# EAGLE design BigLMA (EAGLE 6.1)
DATABASE: ./../../../../eagle/PARTSDB.TXT
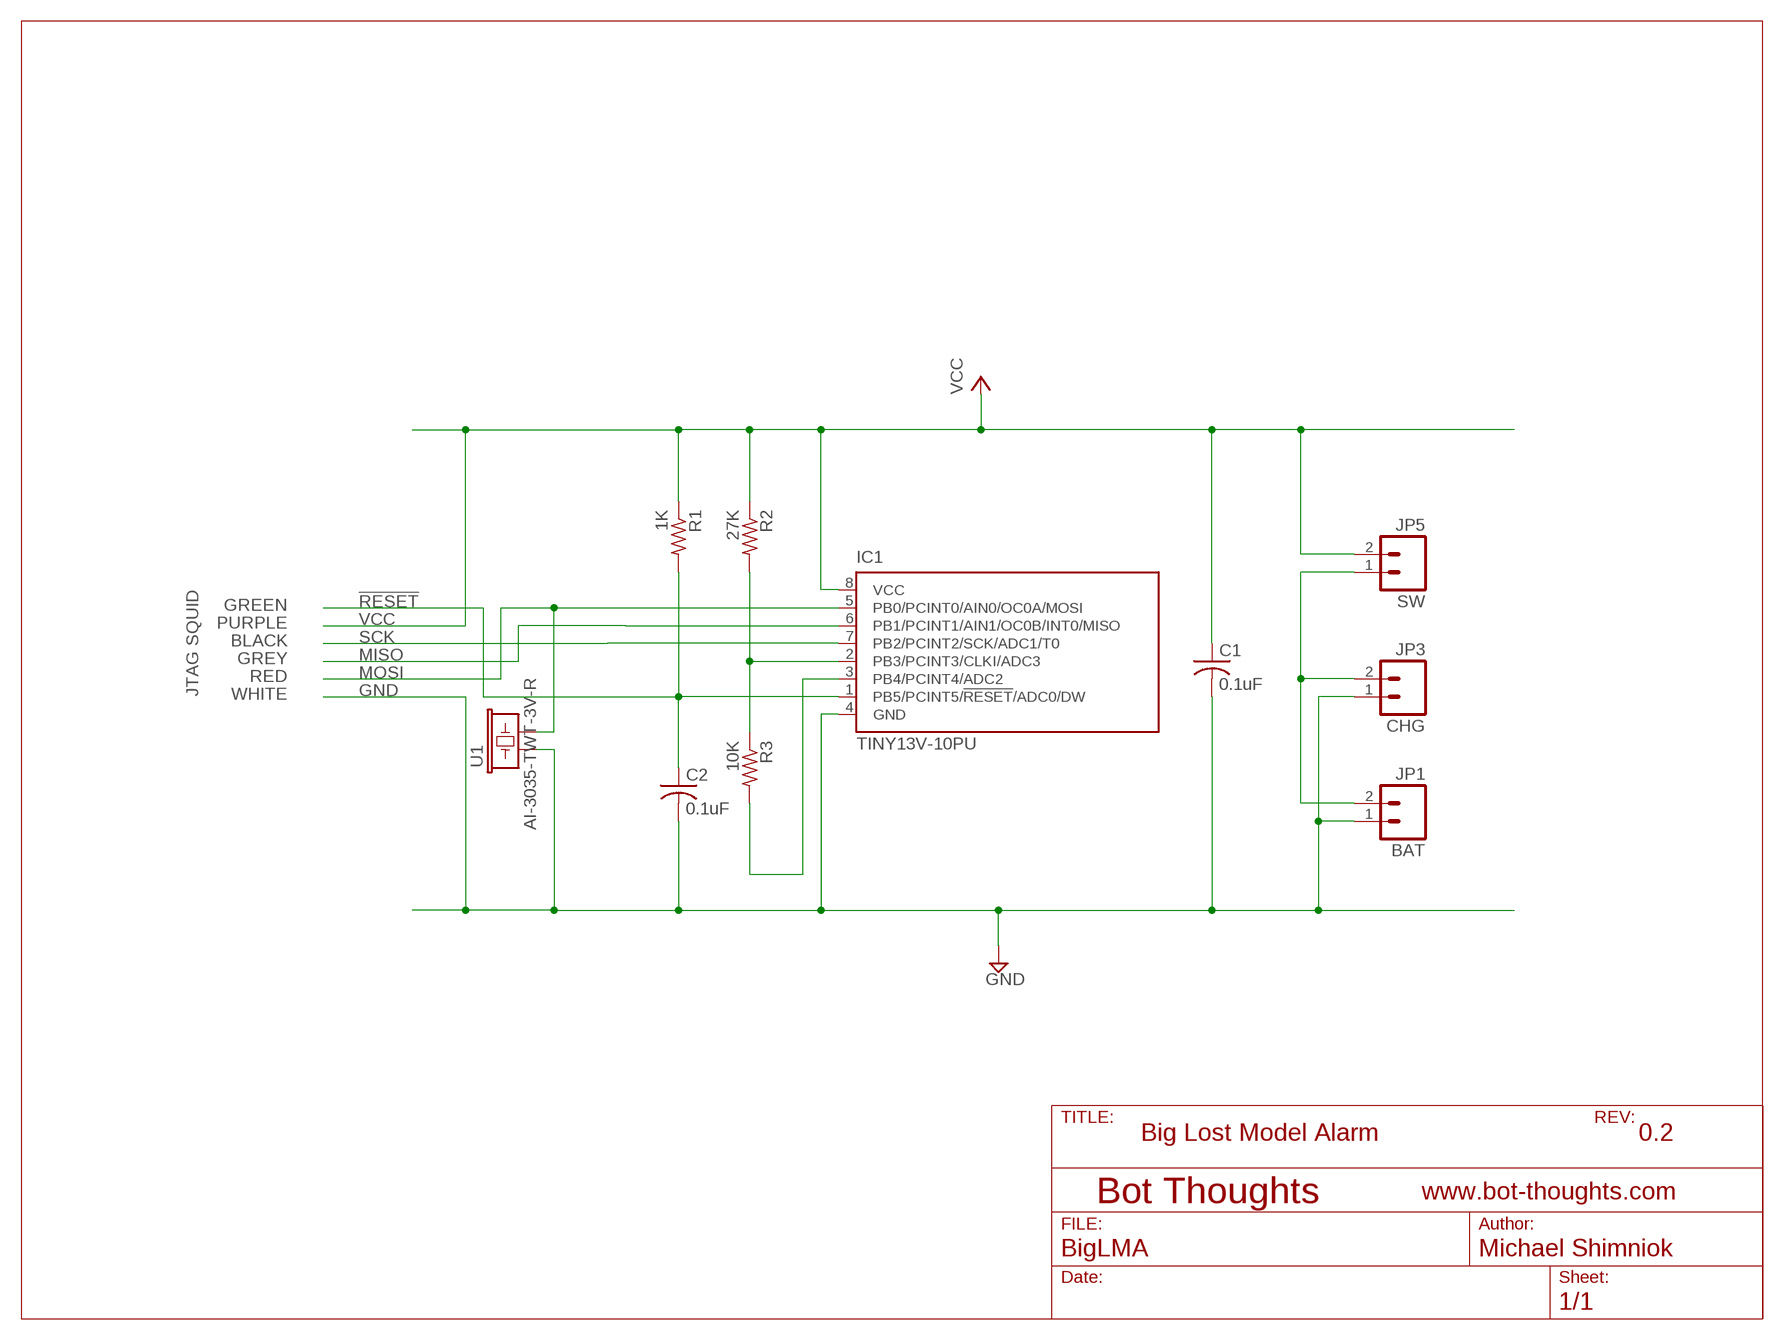
[diagram p0: schematic, sheet 1]

## Parts
C1  0.1uF  C-USC0603  [C0603]
C2  0.1uF  C-USC0603  [C0603]
IC1  TINY13V-10PU  [DIL08]
JP1  BAT  M02JST-PTH-2  [JST-2-PTH]
JP3  CHG  M02PTH  [1X02]
JP5  SW  M02PTH  [1X02]
R1  1K  R-US_R0603  [R0603]
R2  27K  R-US_R0603  [R0603]
R3  10K  R-US_R0603  [R0603]
U1  AI-3035-TWT-3V-R  AI-3035-TWT-3V-RPTH  [BUZZER-30MM_PTH]

## Nets
!RESET: C2.1 IC1.1(PB5/PCINT5/!RESET!/ADC0/DW) R1.2
GND: C1.2 C2.2 IC1.4(GND) JP1.1 JP3.1 U1.P$1
MISO: IC1.6(PB1/PCINT1/AIN1/OC0B/INT0/MISO)
MOSI: IC1.5(PB0/PCINT0/AIN0/OC0A/MOSI) U1.P$2
N$1: IC1.2(PB3/PCINT3/CLKI/ADC3) R2.2 R3.1
N$2: JP1.2 JP3.2 JP5.1
N$3: IC1.3(PB4/PCINT4/ADC2) R3.2
SCK: IC1.7(PB2/PCINT2/SCK/ADC1/T0)
VCC: C1.1 IC1.8(VCC) JP5.2 R1.1 R2.1

## Notes on the sheet
- GREEN
- PURPLE
- BLACK
- GREY
- RED
- WHITE
- JTAG SQUID
- Big Lost Model Alarm | 0.2

## Library data of the parts
C1 C2 = rcl:C-US: CAPACITOR, American symbol; BOM: INCLUDE; PARTNO: GRM188R60J105KA01D
IC1 = atmel:TINY13: 8-bit AVR Microcontroller with 1K Bytes In-System Programmable Flash Source: http://www.atmel.com/dyn/resources/prod_documents/2535S.pdf; BOM: INCLUDE; MPN: ATTINY13V-10PU; OC_FARNELL: 9171576; OC_NEWARK: 96K6523; PARTNO: ATTINY13V-10PU
JP1 JP3 JP5 = SparkFun:M02: Header 2 Standard 2-pin 0.1" header. Use with straight break away headers (SKU : PRT-00116), right angle break away headers (PRT-00553), swiss pins (PRT-00743), machine pins (PRT-00117), and female headers (PRT-00115). Molex polarized connector foot print use with SKU : PRT-08233 with associated crimp pins and housings.
R1 = rcl:R-US_: RESISTOR, American symbol; BOM: INCLUDE; PARTNO: ERJ-3GEYJ102V
R2 = rcl:R-US_: RESISTOR, American symbol; BOM: INCLUDE; PARTNO: RR0816P-273-D
R3 = rcl:R-US_: RESISTOR, American symbol; BOM: INCLUDE; PARTNO: RR0816P-103-D
U1 = mes_buzzers:AI-3035-TWT-3V-R: PUI Audio AI-3035-TWT-3V-R 30mm piezo buzzer, 100dBA, 9mA; BOM: INCLUDE; PARTNO: AI-3035-TWT-3V-R

## Board
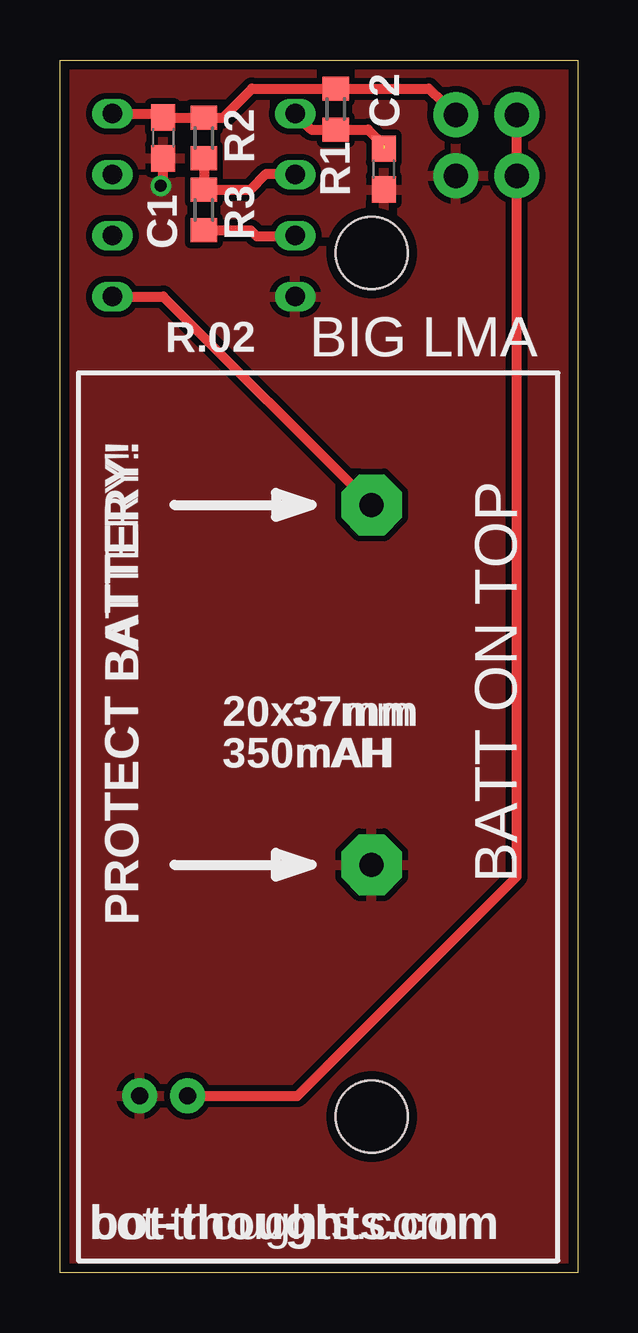
[diagram p1: board, top side]
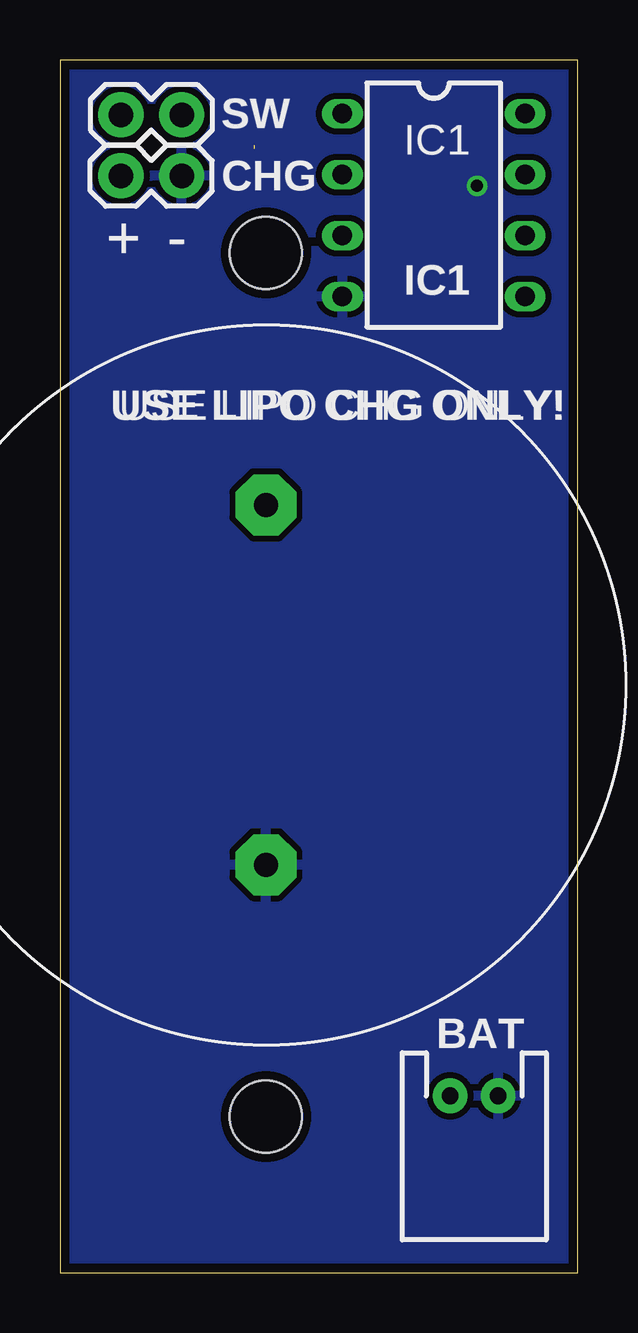
[diagram p2: board, bottom side, seen from below]

Size 21.59 x 50.55 mm. Coordinates in mm from the lower left corner, seen from the top.
Outline: 0,0 0,50.55 21.59,50.55 21.59,0 0,0
Copper layers (1*16): Top 0.0356mm / dielectric 1.5011mm / Bottom 0.0356mm
Design rules: minimum track width 6mil, minimum drill 13mil, track to track 6mil, track to pad 6mil, pad to pad 6mil, via to via 6mil, smd to smd 6mil, copper to edge 15mil, drill to drill 6mil, minimum pad ring 7mil, minimum via ring 7mil, stop-mask expansion 4mil, vias tented up to drill 0mil, thermal gap 10mil
Holes 3 mm at 13,42.5 13,6.5

### Footprints (pad centres in the part's own frame; a part is rotated, then mirrored left to right if it is on the bottom)
C0603 = smd 1.1 x 1: 1 -0.85,0; 2 0.85,0
DIL08 = drill 0.813 long: 1 -3.81,-3.81; 2 -1.27,-3.81; 3 1.27,-3.81; 4 3.81,-3.81; 5 3.81,3.81; 6 1.27,3.81; 7 -1.27,3.81; 8 -3.81,3.81
JST-2-PTH = drill 0.7 pad 1.448: 1 -1,0; 2 1,0
1X02 = drill 1.016 pad 1.88: 1 0,0; 2 2.54,0
R0603 = smd 1 x 1.1: 1 -0.85,0; 2 0.85,0
BUZZER-30MM_PTH = drill 1 pad 2.54 octagon: P$1 -7.5,0; P$2 7.5,0

### Placement (x,y rotation side)
C1  4.3,47.3 270 top
C2  13.5,46 270 top
IC1  6,44.5 270 bottom
JP1  4.32,7.37 180 bottom
JP3  16.51,45.72 180 bottom
JP5  19.05,48.26 0 bottom
R1  11.5,48.5 270 top
R2  6,47.3 270 top
R3  6,44.3 270 top
U1  13,24.5 90 bottom
U$1  [LIPO_20X37]  0.77,0.5 0 top

### Tracks (layer width: path | path; a pad name or v marks a point on that pad's centre or on a via)
!RESET  (1 unrouted)
  Top 0.406: IC1.1 10.47,47.65 R1.2 12.85,47.65 13.5,47
GND  (via drill 0.5)
  Top 0.406: C1.2 4.25,45.35 v4.2,45.3
  pour Bottom (isolate 0.254): 0,50.5 21.5,50.5 21.5,0 0,0
  pour Top (isolate 0.254): 0,50.55 21.59,50.55 21.59,0 0,0
MOSI
  Top 0.406: IC1.5 4.31,40.69 U1.P$2 | U1.P$2
N$1
  Top 0.406: IC1.2 9.78,45.8 8.6,45.8 7.95,45.15 R3.1 R2.2
N$2
  Top 0.406: JP1.2 9.91,7.37 19.05,16.51 JP3.2 JP5.1
N$3
  Top 0.406: R3.2 7.95,43.45 8.2,43.2 9.78,43.2 IC1.3
VCC
  Top 0.406: 11.35,49.35 11.5,49.5 R1.1 | R1.1 15.38,49.35 JP5.2 | IC1.8 4.14,48.31 C1.1 R2.1 6.8,48.15 8,49.35 R1.1

### Text on the board
tPlace: BATT ON TOP
bPlace: - | +
tNames: R.02 | BIG LMA | PROTECT BATTERY! | bot-thoughts.com
bNames: USE LIPO CHG ONLY!
_tsilk: R2 | C2 | R1 | C1 | R3 | R.02 | BIG LMA | 20x37mm | 350mAH | BATT ON TOP | PROTECT BATTERY! | bot-thoughts.com
_bsilk: SW | CHG | - | + | IC1 | USE LIPO CHG ONLY! | BAT